# Altium project CubeControl.PrjPcb
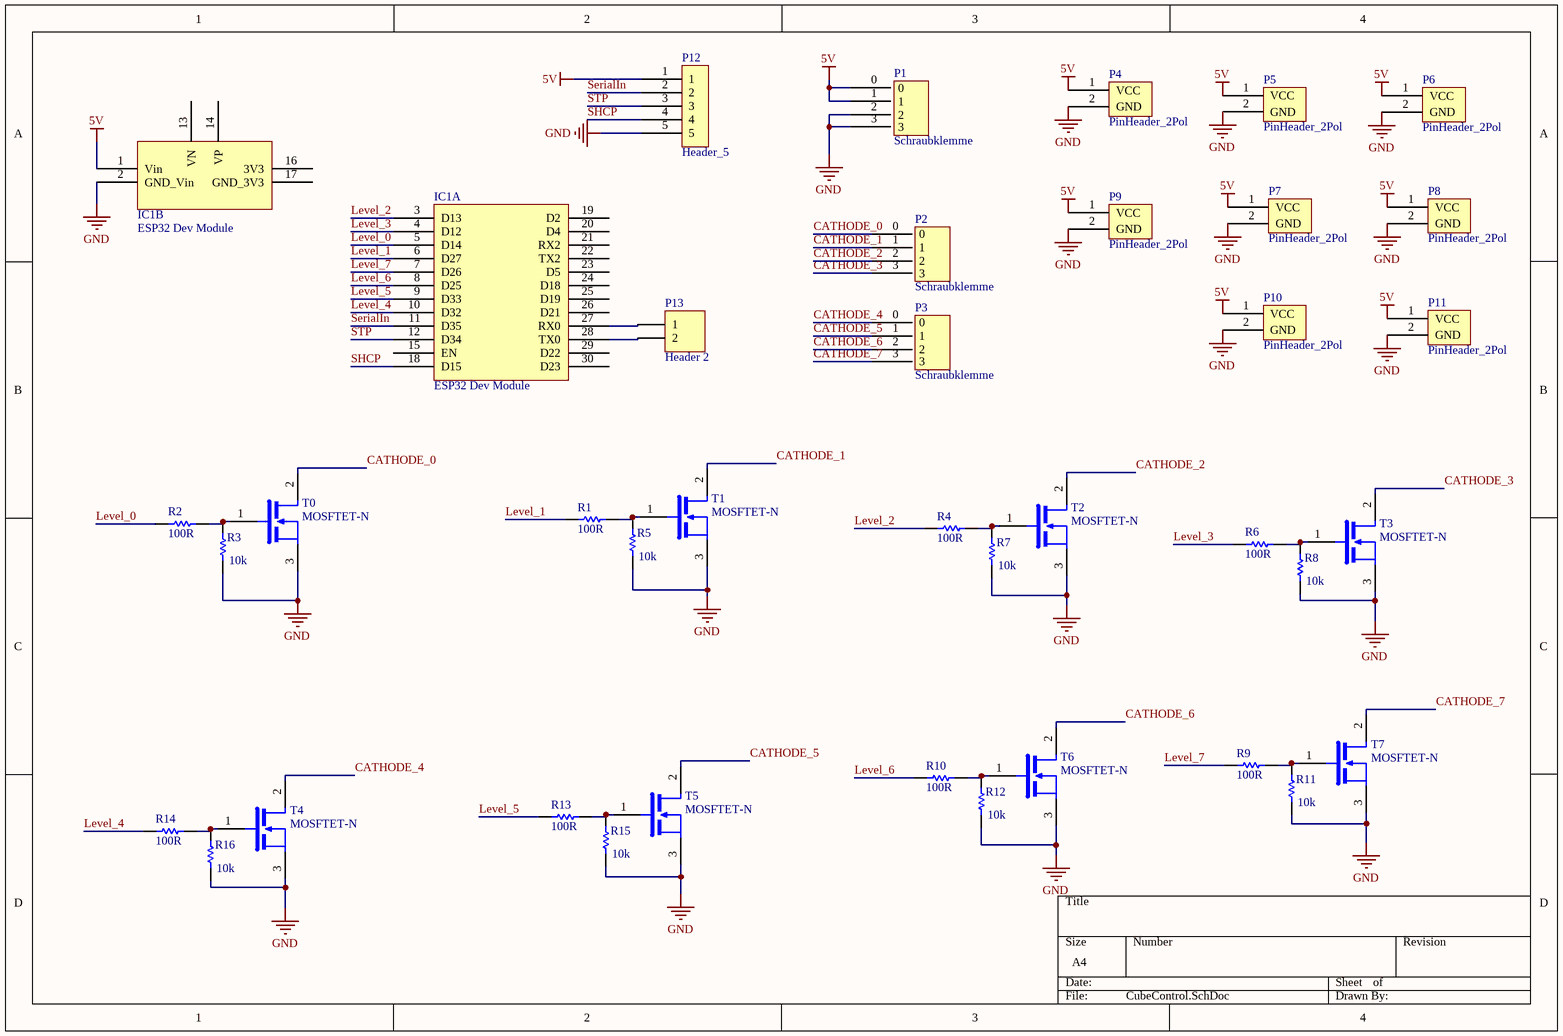
[diagram p0: CubeControl.SchDoc]
1 sheet, 38 parts. Net scope: global (net labels, ports and power ports of the same name join across sheets).
Board file: CubeControl.PcbDoc

## Sheet CubeControl.SchDoc
size A4

### Parts
IC1  ESP32 Dev Module  [ESP32 Dev Module]  (parts A,B of 2)
P1  Schraubklemme  [Schraubklemme 4Pol]
P2  Schraubklemme  [Schraubklemme 4Pol]
P3  Schraubklemme  [Schraubklemme 4Pol]
P4  PinHeader_2Pol  [PinHeader_2Pol]
P5  PinHeader_2Pol  [PinHeader_2Pol]
P6  PinHeader_2Pol  [PinHeader_2Pol]
P7  PinHeader_2Pol  [PinHeader_2Pol]
P8  PinHeader_2Pol  [PinHeader_2Pol]
P9  PinHeader_2Pol  [PinHeader_2Pol]
P10  PinHeader_2Pol  [PinHeader_2Pol]
P11  PinHeader_2Pol  [PinHeader_2Pol]
P12  Header_5  [PinHeader]
P13  Header 2  [HDR1X2]
R1  100R  [RESC1206(3216)_M]
R2  100R  [RESC1206(3216)_M]
R3  10k  [RESC1206(3216)_M]
R4  100R  [RESC1206(3216)_M]
R5  10k  [RESC1206(3216)_M]
R6  100R  [RESC1206(3216)_M]
R7  10k  [RESC1206(3216)_M]
R8  10k  [RESC1206(3216)_M]
R9  100R  [RESC1206(3216)_M]
R10  100R  [RESC1206(3216)_M]
R11  10k  [RESC1206(3216)_M]
R12  10k  [RESC1206(3216)_M]
R13  100R  [RESC1206(3216)_M]
R14  100R  [RESC1206(3216)_M]
R15  10k  [RESC1206(3216)_M]
R16  10k  [RESC1206(3216)_M]
T0  MOSFTET-N  [TO220-3]
T1  MOSFTET-N  [TO220-3]
T2  MOSFTET-N  [TO220-3]
T3  MOSFTET-N  [TO220-3]
T4  MOSFTET-N  [TO220-3]
T5  MOSFTET-N  [TO220-3]
T6  MOSFTET-N  [TO220-3]
T7  MOSFTET-N  [TO220-3]

### Nets
5V: IC1.1(Vin) P1.0 P1.1 P4.1(VCC) P5.1(VCC) P6.1(VCC) P7.1(VCC) P8.1(VCC) P9.1(VCC) P10.1(VCC) P11.1(VCC) P12.1
GND: IC1.2(GND_Vin) P1.2 P1.3 P4.2(GND) P5.2(GND) P6.2(GND) P7.2(GND) P8.2(GND) P9.2(GND) P10.2(GND) P11.2(GND) P12.5 R3.1 R5.1 R7.1 R8.1 R11.1 R12.1 R15.1 R16.1 T0.3 T1.3 T2.3 T3.3 T4.3 T5.3 T6.3 T7.3
CATHODE_0: P2.0 T0.2
CATHODE_1: P2.1 T1.2
CATHODE_2: P2.2 T2.2
CATHODE_3: P2.3 T3.2
CATHODE_4: P3.0 T4.2
CATHODE_5: P3.1 T5.2
CATHODE_6: P3.2 T6.2
CATHODE_7: P3.3 T7.2
Level_0: IC1.5(D14) R2.1
Level_1: IC1.6(D27) R1.1
Level_2: IC1.3(D13) R4.1
Level_3: IC1.4(D12) R6.1
Level_4: IC1.10(D32) R14.1
Level_5: IC1.9(D33) R13.1
Level_6: IC1.8(D25) R10.1
Level_7: IC1.7(D26) R9.1
SerialIn: IC1.11(D35) P12.2
SHCP: IC1.18(D15) P12.4
STP: IC1.12(D34) P12.3
NetIC1_27: IC1.27(RX0) P13.1
NetIC1_28: IC1.28(TX0) P13.2
NetR1_2: R1.2 R5.2 T1.1
NetR2_2: R2.2 R3.2 T0.1
NetR4_2: R4.2 R7.2 T2.1
NetR6_2: R6.2 R8.2 T3.1
NetR9_2: R9.2 R11.2 T7.1
NetR10_2: R10.2 R12.2 T6.1
NetR13_2: R13.2 R15.2 T5.1
NetR14_2: R14.2 R16.2 T4.1

Not connected (* = marked no-connect by the designer): IC1 13(VN) 14(VP) 15(EN) 16(3V3) 17(GND_3V3) 19(D2) 20(D4) 21(RX2) 22(TX2) 23(D5) 24(D18) 25(D19) 26(D21) 29(D22) 30(D23)

### Library data of the parts
P1-P3 = Schraubklemme: Reichelt: RND 205-00003
P13 = Header 2: Header, 2-Pin; LatestRevisionDate: 17-Jul-2002; LatestRevisionNote: Re-released for DXP Platform.; Publisher: Altium Limited
R1 R2 R4 R6 R9 R10 R13 R14 = CMP-1014-00009-1: 2R 0.25W 5% 1206 (3216 Metric)  SMD; Case-EIA: 1206; Value: 2.00 Ohm; Case-Metric: 3216; Technology: SMT; Tolerance: 5 %; Power: 0.25 W
R3 R5 R7 R8 R11 R12 R15 R16 = CMP-1014-00009-1: 43k 0.25W 5% 1206 (3216 Metric)  SMD; Case-EIA: 1206; Value: 2.00 Ohm; Case-Metric: 3216; Technology: SMT; Tolerance: 5 %; Power: 0.25 W
T0-T7 = Mosfet-N: Reichelt: IRF 3708; Supplier 1: Farnell